# EAGLE design fiveChannel-nMOSFET-teensyLC (EAGLE 7.2.0)
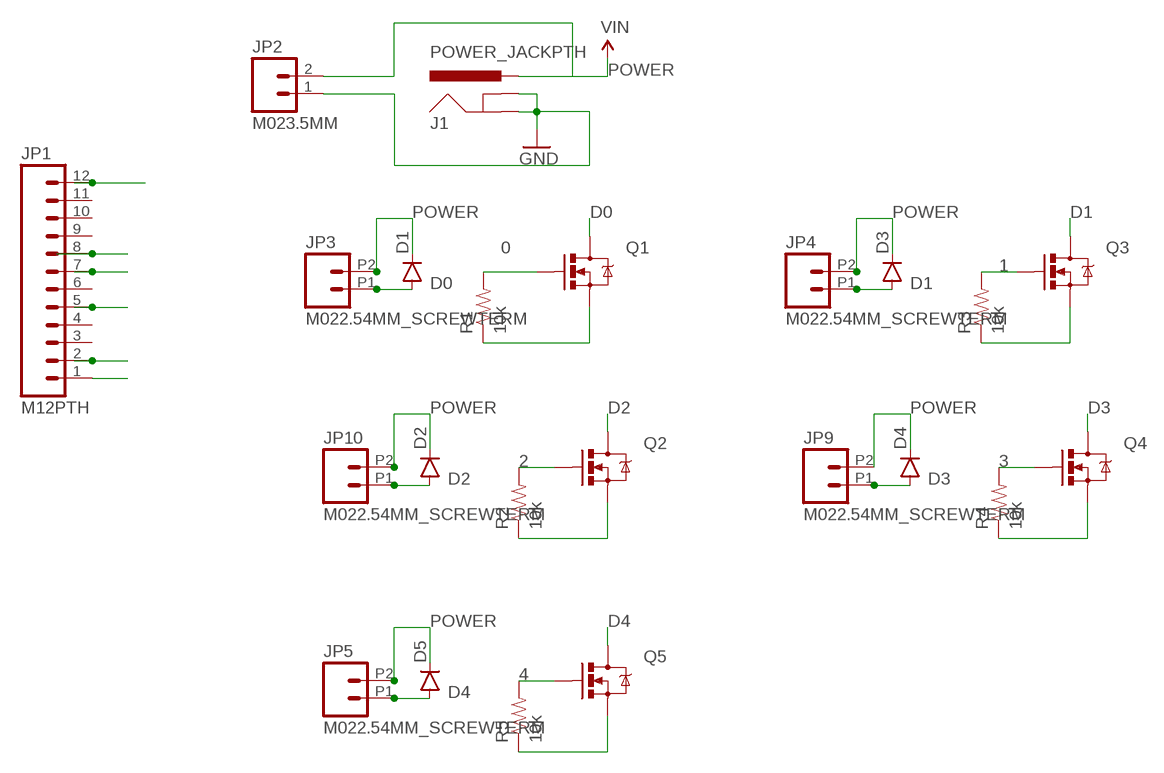
[diagram p0: schematic, sheet 1]

## Parts
D1  DIODEPTH  [DIODE-1N4001]
D2  DIODEPTH  [DIODE-1N4001]
D3  DIODEPTH  [DIODE-1N4001]
D4  DIODEPTH  [DIODE-1N4001]
D5  DIODEPTH  [DIODE-1N4001]
J1  POWER_JACKPTH  [POWER_JACK_PTH]
JP1  M12PTH  [1X12]
JP2  M023.5MM  [SCREWTERMINAL-3.5MM-2]
JP3  M022.54MM_SCREWTERM  [1X02_2.54_SCREWTERM]
JP4  M022.54MM_SCREWTERM  [1X02_2.54_SCREWTERM]
JP5  M022.54MM_SCREWTERM  [1X02_2.54_SCREWTERM]
JP9  M022.54MM_SCREWTERM  [1X02_2.54_SCREWTERM]
JP10  M022.54MM_SCREWTERM  [1X02_2.54_SCREWTERM]
Q1  MOSFET-NCHANNELFQP30N06L  [TO220V]
Q2  MOSFET-NCHANNELFQP30N06L  [TO220V]
Q3  MOSFET-NCHANNELFQP30N06L  [TO220V]
Q4  MOSFET-NCHANNELFQP30N06L  [TO220V]
Q5  MOSFET-NCHANNELFQP30N06L  [TO220V]
R1  10k  10KOHM-1/4W5%(PTH)  [AXIAL-0.3]
R2  10k  10KOHM-1/4W5%(PTH)  [AXIAL-0.3]
R3  10k  10KOHM-1/4W5%(PTH)  [AXIAL-0.3]
R4  10k  10KOHM-1/4W5%(PTH)  [AXIAL-0.3]
R5  10k  10KOHM-1/4W5%(PTH)  [AXIAL-0.3]

## Nets
0: JP1.1 Q1.1(G) R1.P$2
1: JP1.2 Q3.1(G) R3.P$2
2: JP1.5 Q2.1(G) R2.P$2
3: JP1.7 Q4.1(G) R4.P$2
4: JP1.8 Q5.1(G) R5.P$2
D0: D1.A JP3.P1 Q1.2(D)
D1: D3.A JP4.P1 Q3.2(D)
D2: D2.A JP10.P1 Q2.2(D)
D3: D4.A JP9.P1 Q4.2(D)
D4: D5.A JP5.P1 Q5.2(D)
GND: J1.GND J1.GNDBREAK JP1.12 JP2.1 Q1.3(S) Q2.3(S) Q3.3(S) Q4.3(S) Q5.3(S) R1.P$1 R2.P$1 R3.P$1 R4.P$1 R5.P$1
POWER: D1.C D2.C D3.C D4.C D5.C J1.PWR JP2.2 JP3.P2 JP4.P2 JP5.P2 JP9.P2 JP10.P2 ; supply symbol labelled VIN
Unconnected: JP1.3 JP1.4 JP1.6 JP1.9 JP1.10 JP1.11

## Library data of the parts
D1-D5 = SparkFun-DiscreteSemi:DIODE: Diode These are standard reverse protection diodes and small signal diodes. SMA package can handle up to about 1A. SOD-323 can handle about 200mA. What the SOD-323 package when ordering, there are some mfgs out there that are 5-pin packages.
J1 = SparkFun-Connectors:POWER_JACK: Power Jack This is the standard 5.5mm barrel jack for power. The PTH is the most common, proven, reliable, footprint. The Slot footprint only works if the mill layer is transmitted to the PCB fab house so be warned. Mating wall wart : TOL-00298 (and others); PROD_ID: PRT-00119
JP1 = SparkFun-Connectors:M12: Header 12 Standard 12-pin 0.1" header. Use with straight break away headers (SKU : PRT-00116), right angle break away headers (PRT-00553), swiss pins (PRT-00743), machine pins (PRT-00117), and female headers (PRT-00115).
JP2-JP5 JP9 JP10 = SparkFun-Connectors:M02: Standard 2-pin 0.1" header. Use with - straight break away headers ( PRT-00116) - right angle break away headers (PRT-00553) - swiss pins (PRT-00743) - machine pins (PRT-00117) - female headers (PRT-00115) Molex polarized connector foot print use with: PRT-08233 with associated crimp pins and housings. 2.54_SCREWTERM for use with PRT-10571. 3.5mm Screw Terminal footprints for PRT-08084 5mm Screw Terminal footprints for use with PRT-08432
Q1-Q5 = SparkFun-DiscreteSemi:MOSFET-NCHANNEL: Common NMOSFET Parts MFG P/N Store ID Prod ID FDD8780 TRANS-09984 SI7820DN TRANS-11055 FDS6630A IC-08089 2N7002PW TRANS-11151 FQP30N06L COM-10213 TRANS-10060 BSS123LT1G TRANS-08345 BSS138 TRANS-00830 BS170 2N7000; PROD_ID: TRANS-10060
R1-R5 = SparkFun-Resistors:10KOHM-1/4W5%(PTH): RES-09435; PROD_ID: RES-9435

## Board
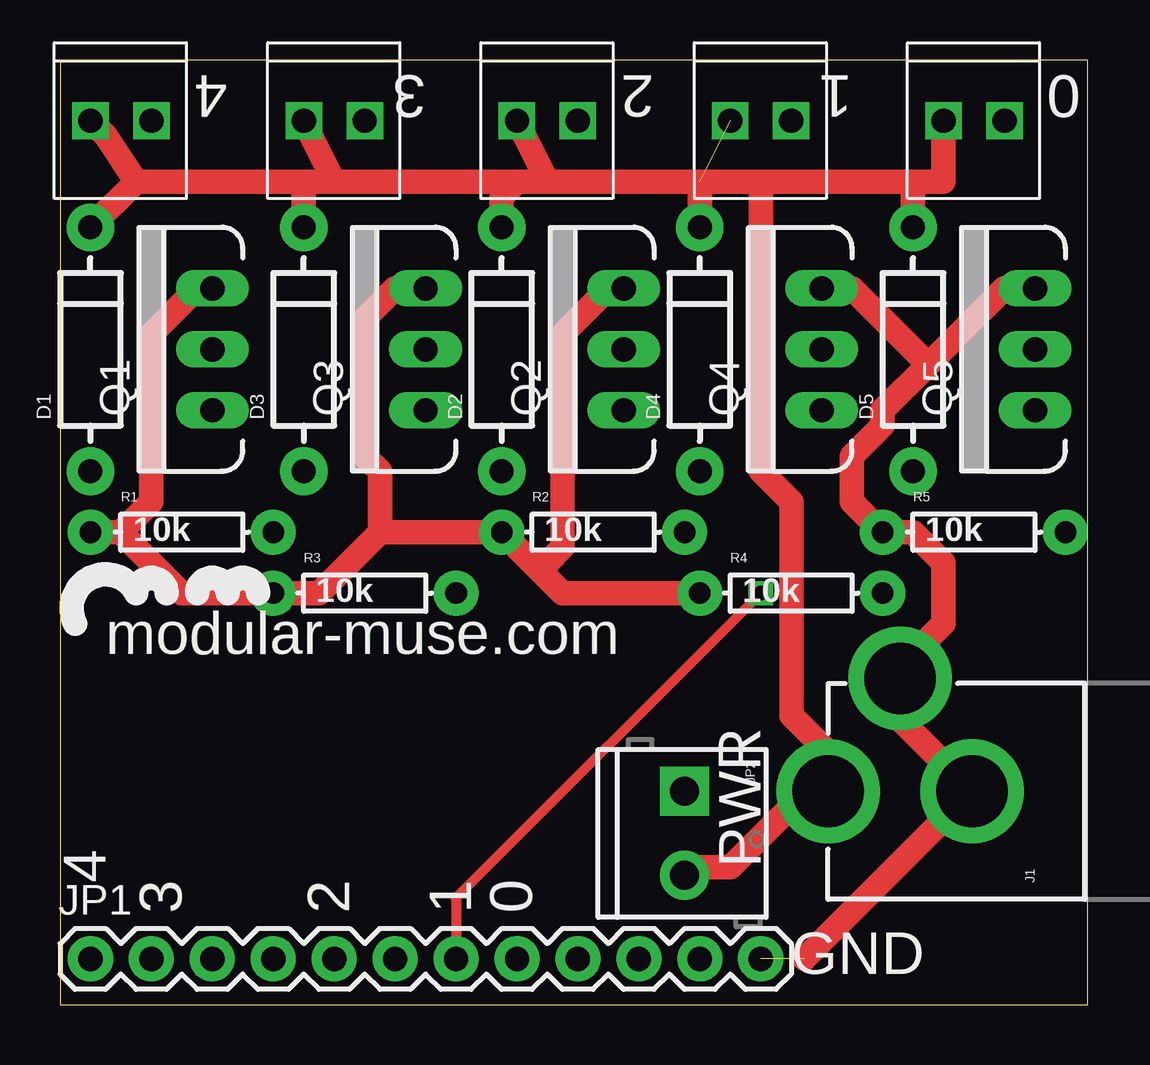
[diagram p1: board, top side]
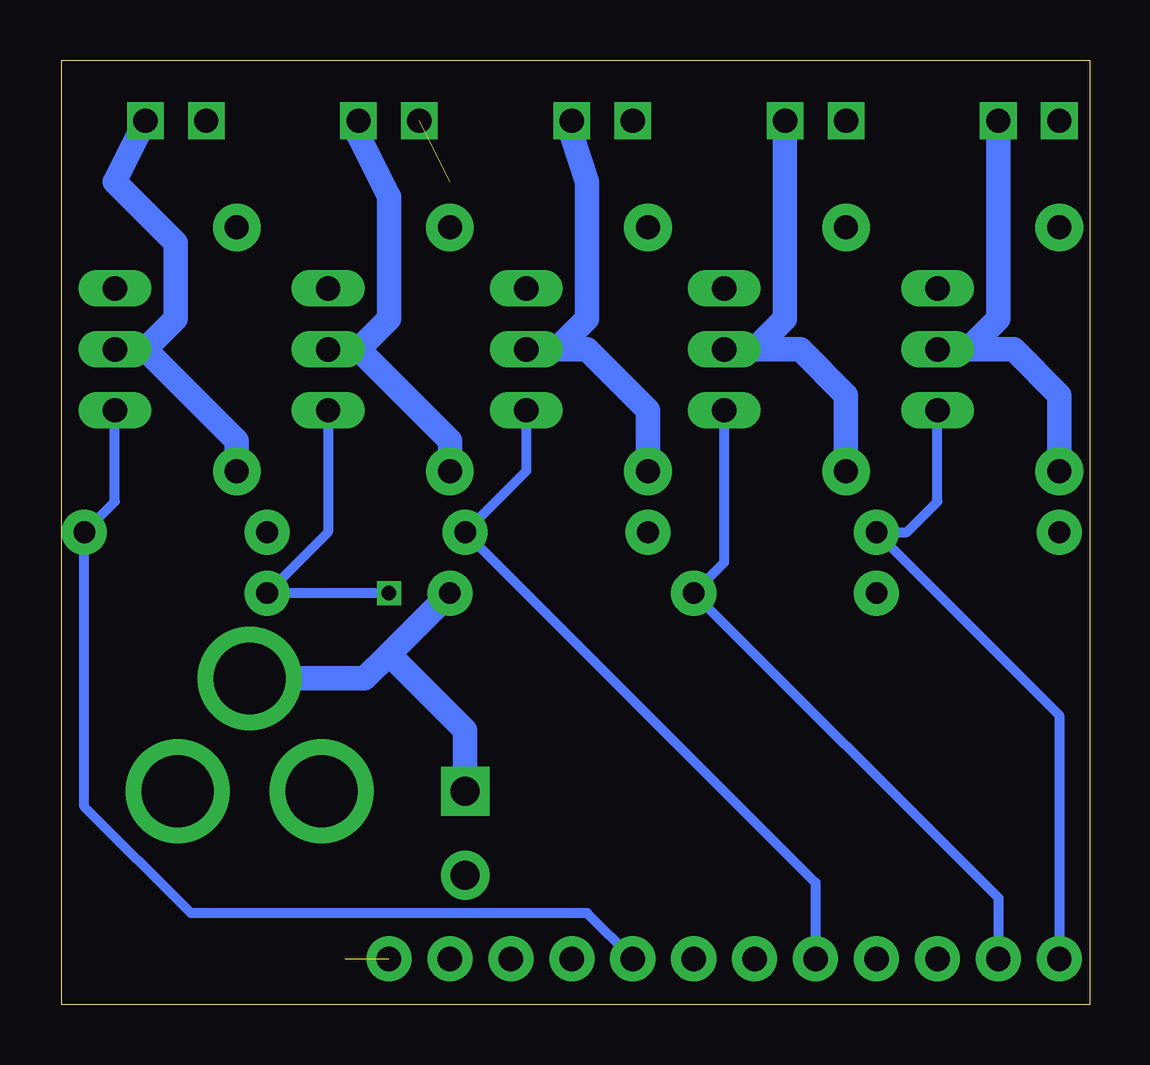
[diagram p2: board, bottom side, seen from below]

Size 42.85 x 39.36 mm. Coordinates in mm from the lower left corner, seen from the top.
Outline: 0,0 42.85,0 42.85,39.36 0,39.36 0,0
Copper layers (1*16): Top 0.035mm / dielectric 1.5mm / Bottom 0.035mm
Design rules "default": minimum track width 10mil, minimum drill 24mil, track to track 8mil, track to pad 8mil, pad to pad 8mil, via to via 8mil, smd to smd 8mil, copper to edge 40mil, drill to drill 8mil, minimum pad ring 10mil, minimum via ring 8mil, stop-mask expansion 4mil, vias tented up to drill 0mil, thermal gap 10mil

### Footprints (pad centres in the part's own frame; a part is rotated, then mirrored left to right if it is on the bottom)
DIODE-1N4001 = drill 1 pad 1.981: A -5.08,0; C 5.08,0
POWER_JACK_PTH = drill 2.997 pad 4.318: GND 0,7.7; GNDBREAK 4.7,10.7; PWR 0,13.7
1X12 = drill 1.016 pad 1.88: 1 0,0; 2 2.54,0; 3 5.08,0; 4 7.62,0; 5 10.16,0; 6 12.7,0; 7 15.24,0; 8 17.78,0; 9 20.32,0; 10 22.86,0; 11 25.4,0; 12 27.94,0
SCREWTERMINAL-3.5MM-2 = drill 1.2 pad 2.032 square: 1 0,0 | drill 1.2 pad 2.032: 2 3.5,0
1X02_2.54_SCREWTERM = drill 1.016 square: P1 2.54,0; P2 0,0
TO220V = drill 1.016 long: 1 -2.54,0; 2 0,0; 3 2.54,0
AXIAL-0.3 = drill 0.9 pad 1.88: P$1 -3.81,0; P$2 3.81,0

### Placement (x,y rotation side)
D1  1.27,27.3 90 top
D2  18.41,27.3 90 top
D3  10.16,27.3 90 top
D4  26.67,27.3 90 top
D5  35.56,27.3 90 top
J1  45.72,8.89 90 top
JP1  1.27,1.9 0 top
JP2  26.04,8.89 270 top
JP3  1.27,36.83 0 top
JP4  10.16,36.83 0 top
JP5  36.83,36.83 0 top
JP9  27.94,36.83 0 top
JP10  19.05,36.83 0 top
Q1  6.35,27.3 90 top
Q2  23.5,27.3 90 top
Q3  15.24,27.3 90 top
Q4  31.75,27.3 90 top
Q5  40.64,27.3 90 top
R1  5.08,19.68 0 top
R2  22.23,19.68 0 top
R3  12.7,17.14 0 top
R4  30.48,17.14 0 top
R5  38.1,19.68 0 top

### Tracks (layer width: path | path; a pad name or v marks a point on that pad's centre or on a via)
0
  Bottom 0.406: Q1.1 6.35,20.95 7.62,19.68 R1.P$2 1.27,12.06 JP1.1
1
  Bottom 0.406: Q3.1 15.24,18.41 R3.P$2 3.81,4.44 JP1.2
2
  Bottom 0.406: Q2.1 23.5,22.22 R2.P$2 11.43,5.08 JP1.5
3  (via drill 0.6)
  Top 0.406: v29.21,17.14 16.51,4.44 JP1.7
  Bottom 0.406: Q4.1 31.75,19.68 R4.P$2 v29.21,17.14
4
  Bottom 0.406: Q5.1 40.64,20.95 R5.P$2 41.91,8.25 37.47,3.81 20.95,3.81 JP1.8
D0
  Bottom 1.016: D1.A 1.27,25.4 3.17,27.3 Q1.2 5.08,27.3 3.81,28.58 JP3.P1
D1
  Bottom 1.016: JP4.P1 12.7,28.58 13.97,27.3 Q3.2 12.06,27.3 10.16,25.4 D3.A
D2
  Bottom 1.016: D2.A 18.41,24.76 20.95,27.3 Q2.2 22.23,27.3 20.95,28.58 20.95,34.29 21.59,36.19 JP10.P1
D3
  Bottom 1.016: 30.48,27.3 29.21,28.58 29.21,33.66 30.48,36.19 JP9.P1 | Q4.2 30.48,27.3 | 30.48,27.3 26.67,23.49 D4.A
D4
  Bottom 1.016: D5.A 35.56,23.49 39.37,27.3 | 39.37,27.3 Q5.2 | JP5.P1 40.64,34.29 38.1,31.75 38.1,28.58 39.37,27.3
GND  (1 unrouted)
  Top 1.016: J1.GNDBREAK 35.02,11.89 J1.GND 31.04,1.9 | R4.P$1 20.95,17.14 19.68,18.41 | 13.34,19.68 10.79,17.14 R3.P$1 5.08,17.14 2.54,19.68 | Q1.3 5.71,29.84 3.81,27.94 3.81,20.95 2.54,19.68 | 2.54,19.68 R1.P$1 | Q2.3 22.86,29.84 20.95,27.94 20.95,19.05 20.32,18.41 19.68,18.41 | 19.68,18.41 R2.P$1 13.34,19.68 | 13.34,19.68 13.34,22.22 12.7,22.86 12.7,28.58 13.97,29.84 Q3.3 | 34.77,13.33 J1.GNDBREAK | J1.GNDBREAK 35.02,14.06 36.83,15.88 36.83,18.41 35.56,19.68 R5.P$1 33.02,20.95 33.02,22.86 34.29,24.13 34.29,24.76 36.2,26.67 | Q5.3 39.37,29.84 36.2,26.67 | Q4.3 33.02,29.84 36.2,26.67
  Bottom 1.016: J1.GNDBREAK 30.23,13.59 29.21,14.6 | 29.21,14.6 R4.P$1 | JP2.1 26.04,11.43 29.21,14.6
POWER  (1 unrouted)
  Top 1.016: 35.56,34.29 29.21,34.29 | 29.21,34.29 26.67,34.29 | 26.67,34.29 20.32,34.29 | 20.32,34.29 19.05,34.29 | 19.05,34.29 11.43,34.29 | 11.43,34.29 10.16,34.29 | 10.16,34.29 3.17,34.29 | 3.17,34.29 D1.C | D3.C 10.16,34.29 | D2.C 18.41,33.66 19.05,34.29 | D4.C 26.67,34.29 | JP2.2 26.36,5.71 27.94,5.71 31.11,8.89 J1.PWR 32.38,8.89 32.38,10.16 30.48,12.06 30.48,20.95 29.21,22.22 29.21,34.29 | 3.17,34.29 1.91,36.19 JP3.P2 | JP4.P2 11.43,34.29 | JP10.P2 20.32,34.29 | D5.C 35.56,34.29 | 35.56,34.29 36.83,34.29 JP5.P2

### Text on the board
tPlace: 4 | 3 | 2 | 1 | 0 | modular-muse.com | 4 | PWR | 3 | 2 | 1 | 0 | GND